# Altium schematic sheet TopLevel.SchDoc: TOP LEVEL
size A4
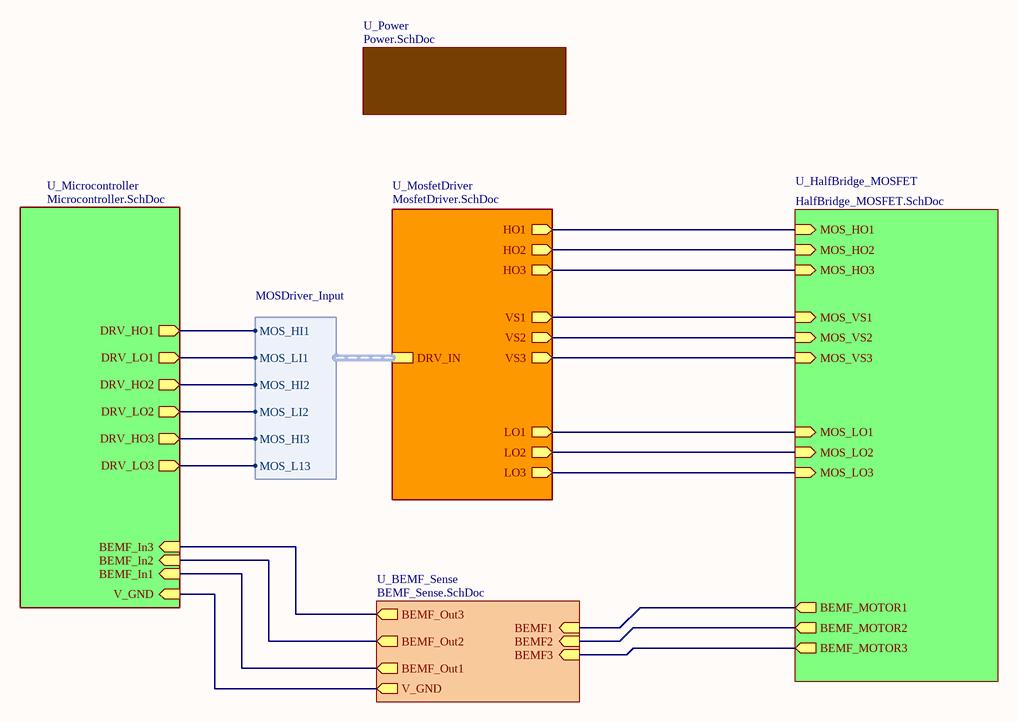
[diagram p0: TopLevel.SchDoc]

## Sub-sheets
U_BEMF_Sense = BEMF_Sense.SchDoc: BEMF_Out3 (out), BEMF_Out1 (out), BEMF_Out2 (out), BEMF1 (in), BEMF2 (in), BEMF3 (in), V_GND (out)
U_HalfBridge_MOSFET = HalfBridge_MOSFET.SchDoc: MOS_HO1 (in), MOS_VS1 (in), MOS_LO1 (in), BEMF_MOTOR1 (out), MOS_HO2 (in), MOS_VS2 (in), MOS_LO2 (in), BEMF_MOTOR2 (out), MOS_HO3 (in), MOS_VS3 (in), MOS_LO3 (in), BEMF_MOTOR3 (out)
U_Microcontroller = Microcontroller.SchDoc: DRV_HO1 (out), DRV_LO2 (out), DRV_LO1 (out), DRV_HO2 (out), DRV_LO3 (out), DRV_HO3 (out), BEMF_In3 (in), BEMF_In2 (in), BEMF_In1 (in), V_GND (in)
U_MosfetDriver = MosfetDriver.SchDoc: DRV_IN (harness MOSDriver_Input), LO1 (out), LO2 (out), LO3 (out), VS3 (out), VS2 (out), VS1 (out), HO3 (out), HO2 (out), HO1 (out)
U_Power = Power.SchDoc: no entries

## Harnesses
MOSDriver_Input: MOS_HI1, MOS_HI2, MOS_HI3, MOS_LI1, MOS_LI2, MOS_L13

## Nets
(unnamed): sheet U_Microcontroller/DRV_HO1, sheet U_MosfetDriver/DRV_IN.MOS_HI1
(unnamed): sheet U_Microcontroller/DRV_LO2, sheet U_MosfetDriver/DRV_IN.MOS_LI2
(unnamed): sheet U_Microcontroller/DRV_LO1, sheet U_MosfetDriver/DRV_IN.MOS_LI1
(unnamed): sheet U_Microcontroller/DRV_HO2, sheet U_MosfetDriver/DRV_IN.MOS_HI2
(unnamed): sheet U_Microcontroller/DRV_LO3, sheet U_MosfetDriver/DRV_IN.MOS_L13
(unnamed): sheet U_Microcontroller/DRV_HO3, sheet U_MosfetDriver/DRV_IN.MOS_HI3
(unnamed): sheet U_Microcontroller/BEMF_In3, sheet U_BEMF_Sense/BEMF_Out3
(unnamed): sheet U_Microcontroller/BEMF_In2, sheet U_BEMF_Sense/BEMF_Out2
(unnamed): sheet U_Microcontroller/BEMF_In1, sheet U_BEMF_Sense/BEMF_Out1
(unnamed): sheet U_Microcontroller/V_GND, sheet U_BEMF_Sense/V_GND
(unnamed): sheet U_MosfetDriver/LO1, sheet U_HalfBridge_MOSFET/MOS_LO1
(unnamed): sheet U_MosfetDriver/LO2, sheet U_HalfBridge_MOSFET/MOS_LO2
(unnamed): sheet U_MosfetDriver/LO3, sheet U_HalfBridge_MOSFET/MOS_LO3
(unnamed): sheet U_MosfetDriver/VS3, sheet U_HalfBridge_MOSFET/MOS_VS3
(unnamed): sheet U_MosfetDriver/VS2, sheet U_HalfBridge_MOSFET/MOS_VS2
(unnamed): sheet U_MosfetDriver/VS1, sheet U_HalfBridge_MOSFET/MOS_VS1
(unnamed): sheet U_MosfetDriver/HO3, sheet U_HalfBridge_MOSFET/MOS_HO3
(unnamed): sheet U_MosfetDriver/HO2, sheet U_HalfBridge_MOSFET/MOS_HO2
(unnamed): sheet U_MosfetDriver/HO1, sheet U_HalfBridge_MOSFET/MOS_HO1
(unnamed): sheet U_BEMF_Sense/BEMF1, sheet U_HalfBridge_MOSFET/BEMF_MOTOR1
(unnamed): sheet U_BEMF_Sense/BEMF2, sheet U_HalfBridge_MOSFET/BEMF_MOTOR2
(unnamed): sheet U_BEMF_Sense/BEMF3, sheet U_HalfBridge_MOSFET/BEMF_MOTOR3

## Notes on the sheet
- Title
- Size:
- Date:
- A4
- Number:
- Time:
- Revision:
- Sheet
- of
- File: